# Altium schematic sheet mainBoard.SchDoc
size A4
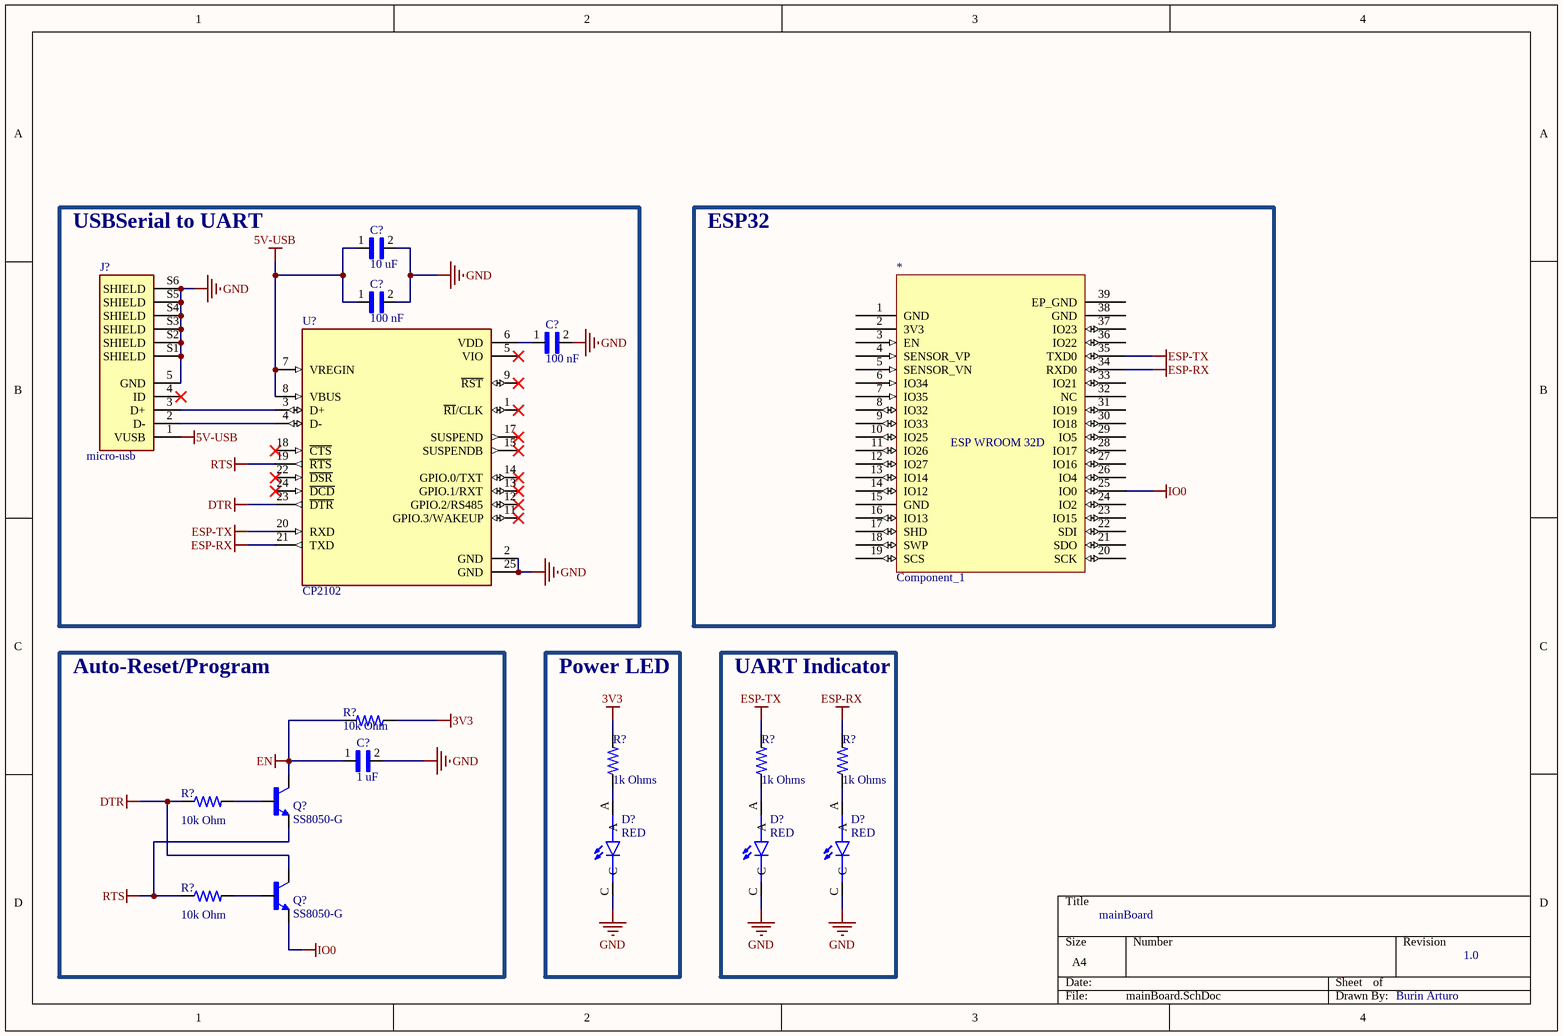
[diagram p0: mainBoard.SchDoc]

## Parts
(Parts that share a designator on the sheet are numbered #1, #2 ... from top to bottom, then left to right.)
*  Component_1  [ESP32-WROOM-32D]
C?#1  10 uF  [CAPC1608X90]
C?#2  100 nF  [CAPC1608X90]
C?#3  100 nF  [CAPC1608X90]
C?#4  1 uF  [CAPC1608X90]
D?#1  RED  [LEDC3216X110]
D?#2  RED  [LEDC3216X110]
D?#3  RED  [LEDC3216X110]
J?  micro-usb  [AMPHENOL_10118193-0001LF]
Q?#1  SS8050-G  [SOT95P240X111-3N]
Q?#2  SS8050-G  [SOT95P240X111-3N]
R?#1  10k Ohm  [RESC2012X65N]
R?#2  1k Ohms  [RESC2012X65N]
R?#3  1k Ohms  [RESC2012X65N]
R?#4  1k Ohms  [RESC2012X65N]
R?#5  10k Ohm  [RESC2012X65N]
R?#6  10k Ohm  [RESC2012X65N]
U?  CP2102  [QFN50P400X400X80-25N]

## Blocks framed on the sheet
USBSerial to UART: C?#1-C?#3 J? U?
ESP32: *
Auto-Reset/Program: C?#4 Q?#1 Q?#2 R?#1 R?#5 R?#6
Power LED: D?#1 R?#2
UART Indicator: D?#2 D?#3 R?#3 R?#4

## Nets
3V3: R?#1.1 R?#2.2
5V-USB: C?#1.1 C?#2.1 J?.1(VUSB) U?.7(VREGIN) U?.8(VBUS)
DTR: Q?#2.3(C) R?#5.1 U?.23(~{DTR})
EN: C?#4.1 Q?#1.3(C) R?#1.2
ESP-RX: *.34(RXD0) R?#4.2 U?.21(TXD)
ESP-TX: *.35(TXD0) R?#3.2 U?.20(RXD)
GND: C?#1.2 C?#2.2 C?#3.2 C?#4.2 D?#1.C D?#2.C D?#3.C J?.5(GND) J?.S1(SHIELD) J?.S2(SHIELD) J?.S3(SHIELD) J?.S4(SHIELD) J?.S5(SHIELD) J?.S6(SHIELD) U?.2(GND) U?.25(GND)
IO0: *.25(IO0) Q?#2.2(E)
RTS: Q?#1.2(E) R?#6.1 U?.19(~{RTS})
NetC?#3_1: C?#3.1 U?.6(VDD)
NetD?#1_A: D?#1.A R?#2.1
NetD?#2_A: D?#2.A R?#3.1
NetD?#3_A: D?#3.A R?#4.1
NetJ?_2: J?.2(D-) U?.4(D-)
NetJ?_3: J?.3(D+) U?.3(D+)
NetQ?#1_1: Q?#1.1(B) R?#5.2
NetQ?#2_1: Q?#2.1(B) R?#6.2

Not connected (* = marked no-connect by the designer): * 1(GND) 2(3V3) 3(EN) 4(SENSOR_VP) 5(SENSOR_VN) 6(IO34) 7(IO35) 8(IO32) 9(IO33) 10(IO25) 11(IO26) 12(IO27) 13(IO14) 14(IO12) 15(GND) 16(IO13) 17(SHD) 18(SWP) 19(SCS) 20(SCK) 21(SDO) 22(SDI) 23(IO15) 24(IO2) 26(IO4) 27(IO16) 28(IO17) 29(IO5) 30(IO18) 31(IO19) 32(NC) 33(IO21) 36(IO22) 37(IO23) 38(GND) 39(EP_GND); J? 4(ID)*; U? 1(~{RI}/CLK)* 5(VIO)* 9(~{RST})* 11(GPIO.3/WAKEUP)* 12(GPIO.2/RS485)* 13(GPIO.1/RXT)* 14(GPIO.0/TXT)* 15(SUSPENDB)* 17(SUSPEND)* 18(~{CTS})* 22(~{DSR})* 24(~{DCD})*

## Notes on the sheet
- mainBoard
- 1.0
- Burin Arturo
- (in symbol Component_1) ESP WROOM 32D

## Library data of the parts
C?#1-C?#4 = LD03ZD475MAB2A: COMMERCIAL CHIP STD JAPAN BULK - FN TAPE/REEL, 7 INCH PAPER TAPE; Package: None; Price: None; Value: *; MP: LD03ZD475MAB2A; Availability: Unavailable
D?#1-D?#3 = LTST-C230KFKT: Orange 605nm LED Indication - Discrete 2V 1206 (3216 Metric); MF: Lite-On Inc.; Package: 1206 Lite-On; Price: None; Check_prices: https://www.snapeda.com/parts/LTST-C230KFKT/Lite-On+Inc./view-part/?ref=eda; Value: *; SnapEDA_Link: https://www.snapeda.com/parts/LTST-C230KFKT/Lite-On+Inc./view-part/?ref=snap; MP: LTST-C230KFKT; Availability: In Stock; Purchase-URL: https://pricing.snapeda.com/search?q=LTST-C230KFKT&ref=eda
J? = 10118193-0001LF: Micro USB 2.0, Input Output Connectors, B TYPE RECEPTACLE; MF: Amphenol ICC; Value: *; MP: 10118193-0001LF; Package: None; Check_prices: https://www.snapeda.com/parts/10118193-0001LF/Amphenol+FCI/view-part/?ref=eda; Purchase-URL: https://pricing.snapeda.com/search/part/10118193-0001LF/?ref=eda; Price: None; Availability: In Stock; SnapEDA_Link: https://www.snapeda.com/parts/10118193-0001LF/Amphenol+FCI/view-part/?ref=snap
Q?#1 Q?#2 = SS8050-G: Bipolar (BJT) Transistor NPN 25 V 1.5 A 100MHz 300 mW Surface Mount SOT-23-3; MP: SS8050G; MF: Comchip; Digi-Key_Part_Number: 641-1790-2-ND; Check_prices: https://www.snapeda.com/parts/SS8050G/Comchip/view-part/?ref=eda; Package: None; SnapEDA_Link: https://www.snapeda.com/parts/SS8050G/Comchip/view-part/?ref=snap; Value: *
R?#1-R?#4 = 1676221-2: RES SMD 1K OHM 0.1% 1/10W 0805; Power_Rating: .1 W; Voltage_Rating: 100 V; MF: TE Connectivity; Tolerance: .1%; SnapEDA_Link: https://www.snapeda.com/parts/1676221-2/TE+Connectivity/view-part/?ref=snap; Package: 0805; MP: 1676221-2; Resistance: 1K; Check_prices: https://www.snapeda.com/parts/1676221-2/TE+Connectivity/view-part/?ref=eda; Price: None; EU_RoHS_Compliance: Compliant; Value: *; Availability: In Stock
R?#5 R?#6 = 1676221-2: RES SMD 1K OHM 0.1% 1/10W 0805; Tolerance: .1%; Power_Rating: .1 W; Voltage_Rating: 100 V; MF: TE Connectivity; Resistance: 1K; SnapEDA_Link: https://www.snapeda.com/parts/1676221-2/TE+Connectivity/view-part/?ref=snap; Package: 0805; MP: 1676221-2; Check_prices: https://www.snapeda.com/parts/1676221-2/TE+Connectivity/view-part/?ref=eda; Price: None; EU_RoHS_Compliance: Compliant; Value: *; Availability: In Stock
U? = CP2102N-A02-GQFN24R: Value: *; MP: CP2102N-A02-GQFN24R; Package: None; Availability: Unavailable; Price: None